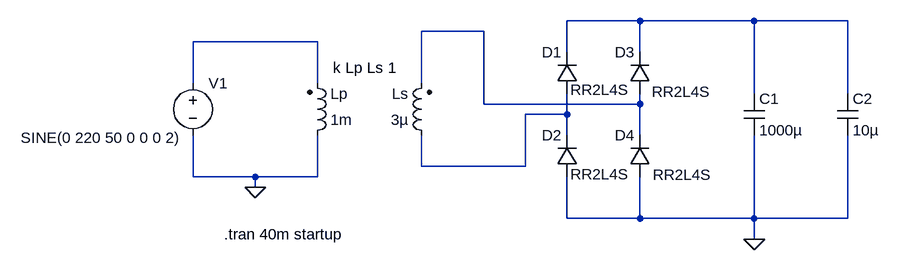
[diagram p0: schematic Linear PSU.asc]
Linear PSU.asc, the LTspice schematic file:
Version 4
SHEET 1 984 680
WIRE 608 32 496 32
WIRE 784 32 608 32
WIRE 928 32 784 32
WIRE 368 48 272 48
WIRE 112 64 -80 64
WIRE 496 80 496 32
WIRE 608 80 608 32
WIRE -80 128 -80 64
WIRE 112 128 112 64
WIRE 272 128 272 48
WIRE 784 144 784 32
WIRE 928 144 928 32
WIRE 368 160 368 48
WIRE 608 160 608 144
WIRE 608 160 368 160
WIRE 496 176 496 144
WIRE 496 176 432 176
WIRE 496 208 496 176
WIRE 608 208 608 160
WIRE 272 256 272 208
WIRE 432 256 432 176
WIRE 432 256 272 256
WIRE -80 272 -80 208
WIRE 16 272 -80 272
WIRE 112 272 112 208
WIRE 112 272 16 272
WIRE 16 288 16 272
WIRE 496 336 496 272
WIRE 608 336 608 272
WIRE 608 336 496 336
WIRE 784 336 784 208
WIRE 784 336 608 336
WIRE 928 336 928 208
WIRE 928 336 784 336
WIRE 784 368 784 336
FLAG 16 288 0
FLAG 784 368 0
SYMBOL voltage -80 112 R0
WINDOW 3 -265 100 Left 2
WINDOW 123 0 0 Left 0
WINDOW 39 0 0 Left 0
SYMATTR InstName V1
SYMATTR Value SINE(0 220 50 0 0 0 2)
SYMBOL ind2 96 224 M180
WINDOW 0 36 80 Left 2
WINDOW 3 36 40 Left 2
SYMATTR InstName Lp
SYMATTR Value 1m
SYMATTR Type ind
SYMATTR SpiceLine Rser=1m
SYMBOL ind2 288 224 R180
WINDOW 0 36 80 Left 2
WINDOW 3 36 40 Left 2
SYMATTR InstName Ls
SYMATTR Value 3µ
SYMATTR Type ind
SYMATTR SpiceLine Rser=1m
SYMBOL diode 624 144 R180
WINDOW 0 24 64 Left 2
WINDOW 3 -93 3 Left 2
SYMATTR InstName D3
SYMATTR Value RR2L4S
SYMBOL cap 768 144 R0
SYMATTR InstName C1
SYMATTR Value 1000µ
SYMBOL diode 512 144 R180
WINDOW 0 24 64 Left 2
WINDOW 3 -80 6 Left 2
SYMATTR InstName D1
SYMATTR Value RR2L4S
SYMBOL diode 512 272 R180
WINDOW 0 24 64 Left 2
WINDOW 3 -80 4 Left 2
SYMATTR InstName D2
SYMATTR Value RR2L4S
SYMBOL diode 624 272 R180
WINDOW 0 24 64 Left 2
WINDOW 3 -95 3 Left 2
SYMATTR InstName D4
SYMATTR Value RR2L4S
SYMBOL cap 912 144 R0
SYMATTR InstName C2
SYMATTR Value 10µ
TEXT 136 104 Left 2 !k Lp Ls 1
TEXT -32 360 Left 2 !.tran 40m startup

The netlist it stands for:
* Linear PSU.asc
V1 N003 0 SINE(0 220 50 0 0 0 2)
Lp 0 N003 1m Rser=1m
Ls N004 N002 3µ Rser=1m
D3 N002 N001 RR2L4S
C1 N001 0 1000µ
D1 N004 N001 RR2L4S
D2 0 N004 RR2L4S
D4 0 N002 RR2L4S
C2 N001 0 10µ
.model D D
.lib standard.dio
k Lp Ls 1
.tran 40m startup
.backanno
.end